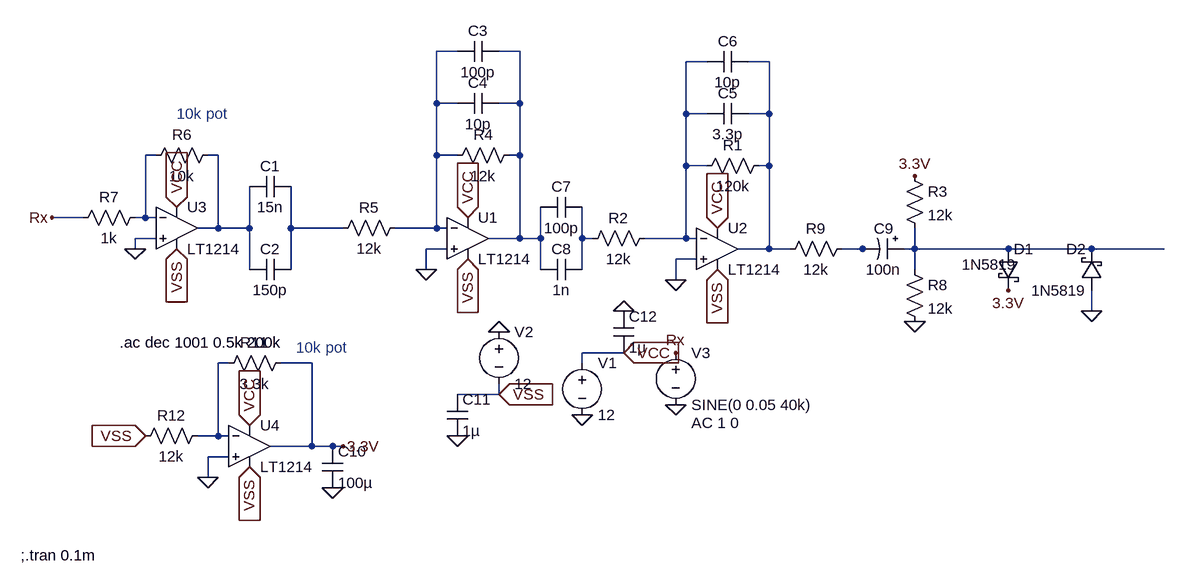
[diagram p0: schematic RxFinal.asc]
RxFinal.asc, the LTspice schematic file:
Version 4
SHEET 1 1636 760
WIRE 176 -32 144 -32
WIRE 272 -32 240 -32
WIRE 560 -16 528 -16
WIRE 656 -16 624 -16
WIRE 144 48 144 -32
WIRE 176 48 144 48
WIRE 272 48 272 -32
WIRE 272 48 240 48
WIRE 528 64 528 -16
WIRE 560 64 528 64
WIRE 656 64 656 -16
WIRE 656 64 624 64
WIRE -288 128 -304 128
WIRE -192 128 -208 128
WIRE 144 128 144 48
WIRE 176 128 144 128
WIRE 272 128 272 48
WIRE 272 128 256 128
WIRE 528 144 528 64
WIRE 560 144 528 144
WIRE 656 144 656 64
WIRE 656 144 640 144
WIRE -400 224 -448 224
WIRE -304 224 -304 128
WIRE -304 224 -320 224
WIRE -288 224 -304 224
WIRE -192 240 -192 128
WIRE -192 240 -224 240
WIRE -144 240 -144 176
WIRE -144 240 -192 240
WIRE -80 240 -80 176
WIRE 0 240 -80 240
WIRE 144 240 144 128
WIRE 144 240 80 240
WIRE 160 240 144 240
WIRE -288 256 -320 256
WIRE 272 256 272 128
WIRE 272 256 224 256
WIRE 304 256 304 208
WIRE 304 256 272 256
WIRE 368 256 368 208
WIRE 384 256 368 256
WIRE 528 256 528 144
WIRE 528 256 464 256
WIRE 544 256 528 256
WIRE -320 272 -320 256
WIRE 160 272 128 272
WIRE 656 272 656 144
WIRE 656 272 608 272
WIRE 688 272 656 272
WIRE 800 272 768 272
WIRE 816 272 800 272
WIRE 880 272 880 240
WIRE 880 272 864 272
WIRE 1024 272 880 272
WIRE 1152 272 1024 272
WIRE 1264 272 1152 272
WIRE 544 288 512 288
WIRE -144 304 -144 240
WIRE -80 304 -80 240
WIRE 128 304 128 272
WIRE 304 304 304 256
WIRE 368 304 368 256
WIRE 880 304 880 272
WIRE 512 320 512 288
WIRE 1152 368 1152 336
WIRE 432 432 368 432
WIRE -176 448 -192 448
WIRE -48 448 -96 448
WIRE 368 448 368 432
WIRE 240 496 240 480
WIRE 240 496 176 496
WIRE -192 560 -192 448
WIRE -192 560 -224 560
WIRE -176 560 -192 560
WIRE -48 576 -48 448
WIRE -48 576 -112 576
WIRE -16 576 -48 576
WIRE 0 576 -16 576
WIRE -176 592 -208 592
WIRE -208 624 -208 592
FLAG 512 320 0
FLAG 368 528 0
FLAG 240 400 0
FLAG 576 240 VCC
IOPIN 576 240 In
FLAG 576 304 VSS
IOPIN 576 304 In
FLAG 512 512 0
FLAG 128 304 0
FLAG 192 224 VCC
IOPIN 192 224 In
FLAG 192 288 VSS
IOPIN 192 288 In
FLAG 880 384 0
FLAG 880 160 3.3V
FLAG 0 576 3.3V
FLAG -208 624 0
FLAG -144 544 VCC
IOPIN -144 544 In
FLAG -144 608 VSS
IOPIN -144 608 In
FLAG -304 560 VSS
IOPIN -304 560 In
FLAG 512 432 Rx
FLAG 1152 368 0
FLAG 1024 336 3.3V
FLAG -320 272 0
FLAG -448 224 Rx
FLAG -256 272 VSS
IOPIN -256 272 In
FLAG -256 208 VCC
IOPIN -256 208 In
FLAG -16 640 0
FLAG 176 560 0
FLAG 432 368 0
FLAG 240 496 VSS
IOPIN 240 496 In
FLAG 432 432 VCC
IOPIN 432 432 In
SYMBOL voltage 368 432 R0
WINDOW 123 0 0 Left 0
WINDOW 39 0 0 Left 0
SYMATTR InstName V1
SYMATTR Value 12
SYMBOL voltage 240 384 R0
WINDOW 123 0 0 Left 0
WINDOW 39 0 0 Left 0
SYMATTR InstName V2
SYMATTR Value 12
SYMBOL res 656 128 R90
WINDOW 0 0 56 VBottom 2
WINDOW 3 32 56 VTop 2
SYMATTR InstName R1
SYMATTR Value 120k
SYMBOL res 480 240 R90
WINDOW 0 0 56 VBottom 2
WINDOW 3 32 56 VTop 2
SYMATTR InstName R2
SYMATTR Value 12k
SYMBOL res 272 112 R90
WINDOW 0 0 56 VBottom 2
WINDOW 3 32 56 VTop 2
SYMATTR InstName R4
SYMATTR Value 12k
SYMBOL res 96 224 R90
WINDOW 0 0 56 VBottom 2
WINDOW 3 32 56 VTop 2
SYMATTR InstName R5
SYMATTR Value 12k
SYMBOL Opamps\\LT1214 192 192 R0
SYMATTR InstName U1
SYMBOL Opamps\\LT1214 576 208 R0
SYMATTR InstName U2
SYMBOL cap -80 160 R90
WINDOW 0 0 32 VBottom 2
WINDOW 3 32 32 VTop 2
SYMATTR InstName C1
SYMATTR Value 15n
SYMBOL cap -80 288 R90
WINDOW 0 0 32 VBottom 2
WINDOW 3 32 32 VTop 2
SYMATTR InstName C2
SYMATTR Value 150p
SYMBOL cap 240 -48 R90
WINDOW 0 0 32 VBottom 2
WINDOW 3 32 32 VTop 2
SYMATTR InstName C3
SYMATTR Value 100p
SYMBOL cap 240 32 R90
WINDOW 0 0 32 VBottom 2
WINDOW 3 32 32 VTop 2
SYMATTR InstName C4
SYMATTR Value 10p
SYMBOL cap 624 48 R90
WINDOW 0 0 32 VBottom 2
WINDOW 3 32 32 VTop 2
SYMATTR InstName C5
SYMATTR Value 3.3p
SYMBOL cap 624 -32 R90
WINDOW 0 0 32 VBottom 2
WINDOW 3 32 32 VTop 2
SYMATTR InstName C6
SYMATTR Value 10p
SYMBOL cap 368 192 R90
WINDOW 0 0 32 VBottom 2
WINDOW 3 32 32 VTop 2
SYMATTR InstName C7
SYMATTR Value 100p
SYMBOL cap 368 288 R90
WINDOW 0 0 32 VBottom 2
WINDOW 3 32 32 VTop 2
SYMATTR InstName C8
SYMATTR Value 1n
SYMBOL polcap 864 256 R90
WINDOW 0 0 32 VBottom 2
WINDOW 3 32 32 VTop 2
SYMATTR InstName C9
SYMATTR Value 100n
SYMBOL res 864 144 R0
SYMATTR InstName R3
SYMATTR Value 12k
SYMBOL res 864 288 R0
SYMATTR InstName R8
SYMATTR Value 12k
SYMBOL Opamps\\LT1214 -144 512 R0
SYMATTR InstName U4
SYMBOL res -80 432 R90
WINDOW 0 0 56 VBottom 2
WINDOW 3 32 56 VTop 2
SYMATTR InstName R11
SYMATTR Value 3.3k
SYMBOL res -208 544 R90
WINDOW 0 0 56 VBottom 2
WINDOW 3 32 56 VTop 2
SYMATTR InstName R12
SYMATTR Value 12k
SYMBOL voltage 512 416 R0
WINDOW 123 24 124 Left 2
WINDOW 39 0 0 Left 0
SYMATTR Value2 AC 1 0
SYMATTR InstName V3
SYMATTR Value SINE(0 0.05 40k)
SYMBOL schottky 1008 272 R0
WINDOW 3 -56 24 Left 2
SYMATTR Value 1N5819
SYMATTR InstName D1
SYMATTR Description Diode
SYMATTR Type diode
SYMBOL schottky 1168 336 R180
WINDOW 0 24 64 Left 2
WINDOW 3 24 0 Left 2
SYMATTR InstName D2
SYMATTR Value 1N5819
SYMATTR Description Diode
SYMATTR Type diode
SYMBOL Opamps\\LT1214 -256 176 R0
SYMATTR InstName U3
SYMBOL res -192 112 R90
WINDOW 0 0 56 VBottom 2
WINDOW 3 32 56 VTop 2
SYMATTR InstName R6
SYMATTR Value 10k
SYMBOL res -304 208 R90
WINDOW 0 0 56 VBottom 2
WINDOW 3 32 56 VTop 2
SYMATTR InstName R7
SYMATTR Value 1k
SYMBOL cap -32 576 R0
SYMATTR InstName C10
SYMATTR Value 100µ
SYMBOL res 784 256 R90
WINDOW 0 0 56 VBottom 2
WINDOW 3 32 56 VTop 2
SYMATTR InstName R9
SYMATTR Value 12k
SYMBOL cap 160 496 R0
SYMATTR InstName C11
SYMATTR Value 1µ
SYMBOL cap 416 368 R0
SYMATTR InstName C12
SYMATTR Value 1µ
TEXT -344 416 Left 2 !.ac dec 1001 0.5k 200k
TEXT -256 64 Left 2 ;10k pot
TEXT -72 424 Left 2 ;10k pot
TEXT -496 744 Left 2 !;.tran 0.1m

The netlist it stands for:
* RxFinal.asc
V1 VCC 0 12
V2 0 VSS 12
R1 N004 N003 120k
R2 N003 N008 12k
R4 N002 N001 12k
R5 N001 N007 12k
XU1 0 N001 VCC VSS N002 LT1213  ; LT1214, pins In+ In- V+ V- OUT
XU2 0 N003 VCC VSS N004 LT1213  ; LT1214, pins In+ In- V+ V- OUT
C1 N007 N006 15n
C2 N007 N006 150p
C3 N002 N001 100p
C4 N002 N001 10p
C5 N004 N003 3.3p
C6 N004 N003 10p
C7 N008 N002 100p
C8 N008 N002 1n
C9 N010 N009 100n
R3 3.3V N010 12k
R8 N010 0 12k
XU4 0 N011 VCC VSS 3.3V LT1213  ; LT1214, pins In+ In- V+ V- OUT
R11 3.3V N011 3.3k
R12 N011 VSS 12k
V3 Rx 0 SINE(0 0.05 40k) AC 1 0
D1 N010 3.3V 1N5819
D2 0 N010 1N5819
XU3 0 N005 VCC VSS N006 LT1213  ; LT1214, pins In+ In- V+ V- OUT
R6 N006 N005 10k
R7 N005 Rx 1k
C10 3.3V 0 100µ
R9 N009 N004 12k
C11 VSS 0 1µ
C12 0 VCC 1µ
.model D D
.lib standard.dio
.ac dec 1001 0.5k 200k
* 10k pot
* 10k pot
;.tran 0.1m
.lib LTC.lib
.backanno
.end